# EAGLE design AST1025 (EAGLE 6.3)
DATABASE: ./../../../../../Components/TinyCircuits_Part_Database.txt
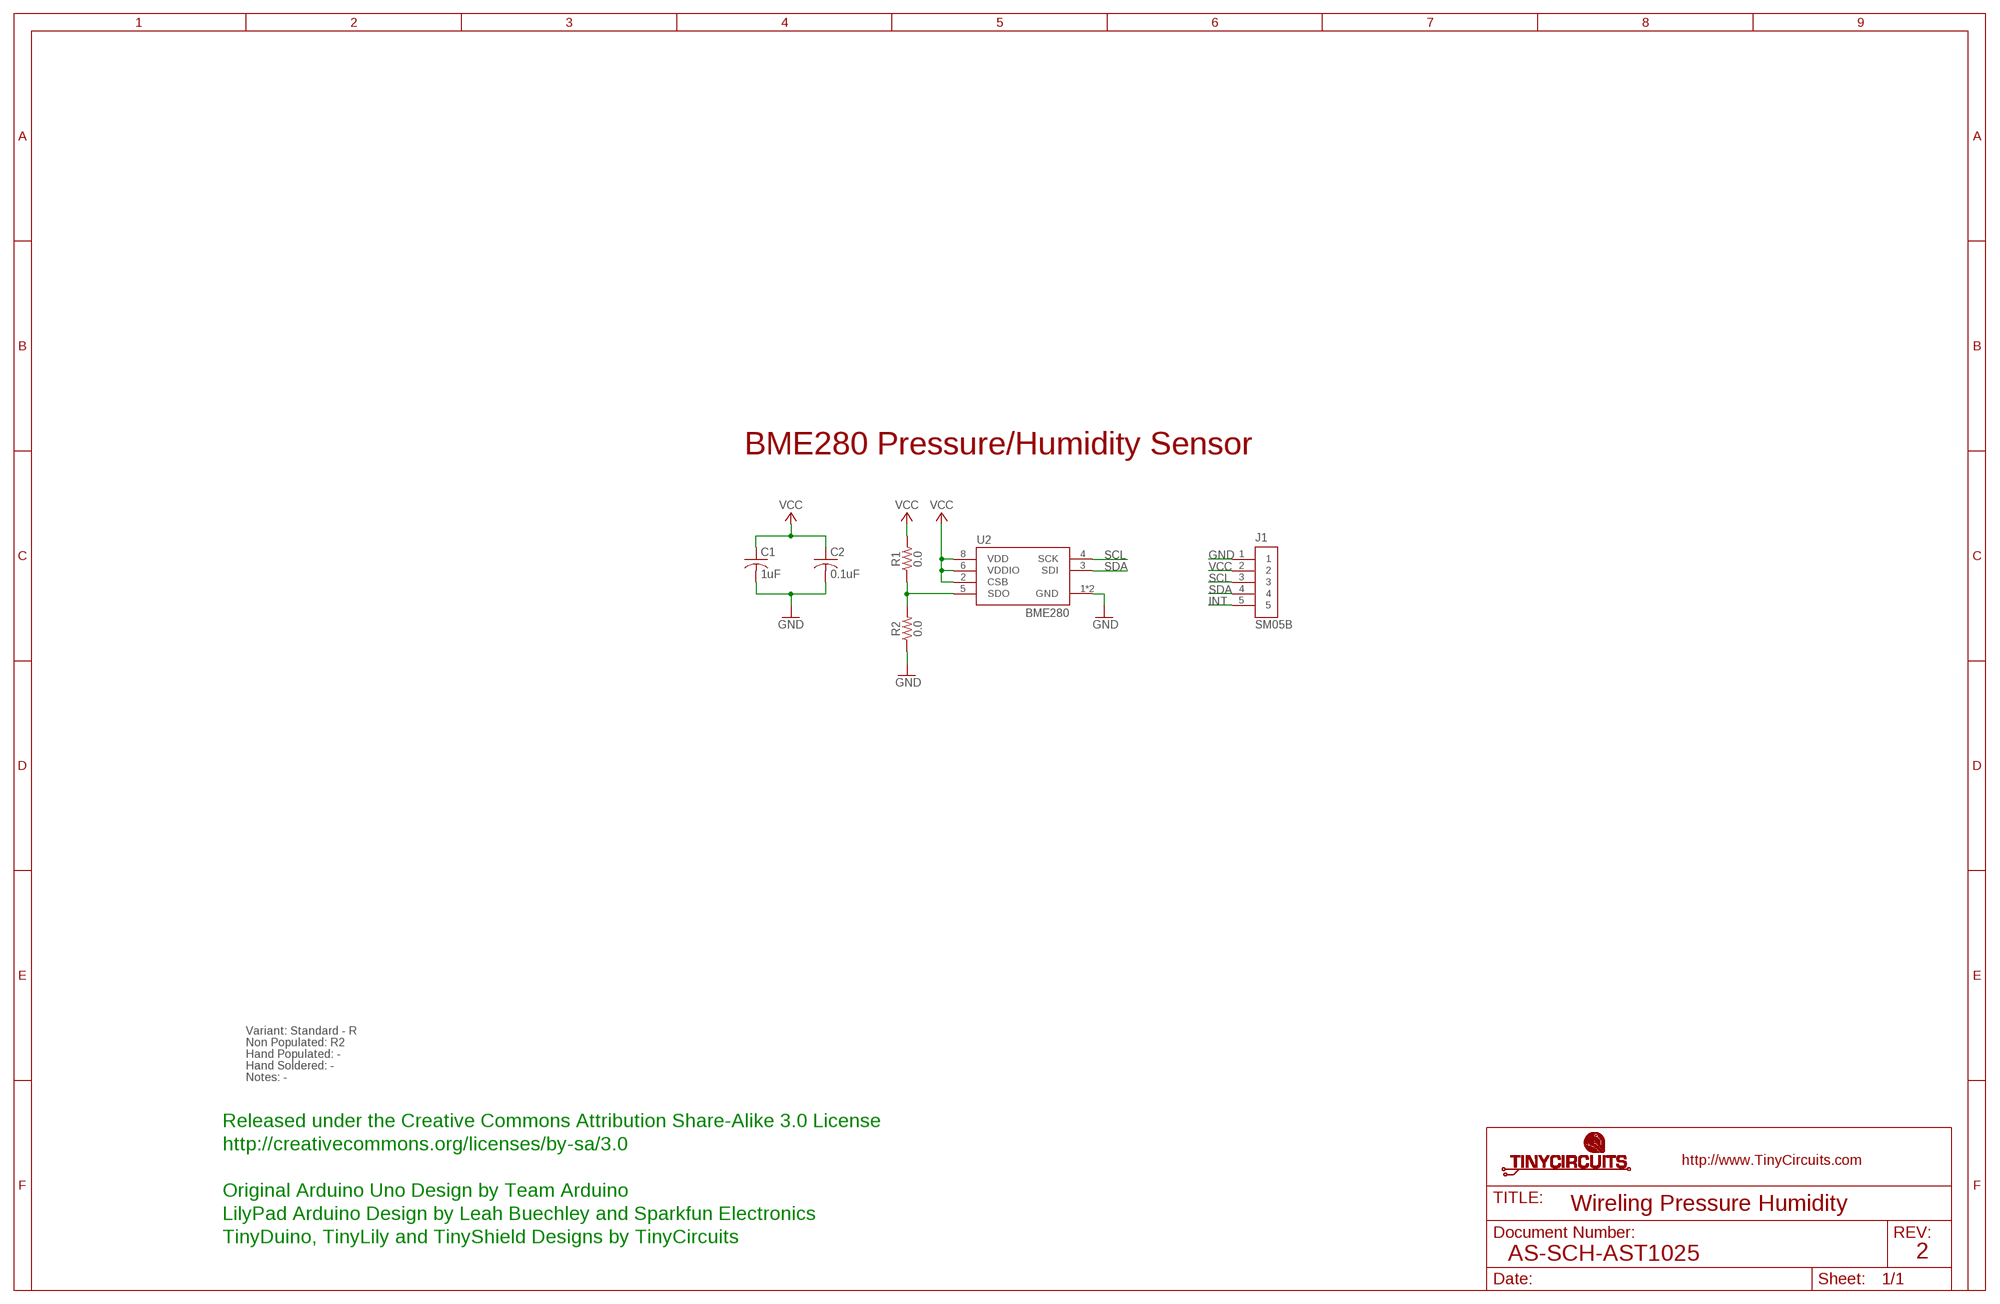
[diagram p0: schematic, sheet 1]

## Parts
C1  1uF  AS-ITM-00410  [C0603]
C2  0.1uF  AS-ITM-00008  [C0402]
J1  SM05B  AS-ITM-00340EDGE  [JST_SH_5X1_EDGE]
R1  0.0  AS-ITM-00076  [0402]
R2  0.0  AS-ITM-00076  [0402]
U2  BME280  AS-ITM-00365  [BME280]

## Nets
GND: C1.2 C2.2 J1.1 R2.1 U2.1(GND) U2.7(GND)
INT: J1.5
N$1: R1.1 R2.2 U2.5(SDO)
SCL: J1.3 U2.4(SCK)
SDA: J1.4 U2.3(SDI)
VCC: C1.1 C2.1 J1.2 R1.2 U2.2(CSB) U2.6(VDDIO) U2.8(VDD)

## Notes on the sheet
- BME280 Pressure/Humidity Sensor
- Variant: Standard - R
- Non Populated: R2
- Hand Populated: -
- Hand Soldered: -
- Notes: -
- Released under the Creative Commons Attribution Share-Alike 3.0 License
- http://creativecommons.org/licenses/by-sa/3.0
- Original Arduino Uno Design by Team Arduino
- Wireling Pressure Humidity
- LilyPad Arduino Design by Leah Buechley and Sparkfun Electronics
- TinyDuino, TinyLily and TinyShield Designs by TinyCircuits
- AS-SCH-AST1025 | 2

## Library data of the parts
C1 = tinycircuits:AS-ITM-00410: CAP CER 1UF 10V X5R 0603; PARTNO: AS-ITM-00410
C2 = tinycircuits:AS-ITM-00008: CAP CER 0.1UF 16V 10% X5R 0402; PARTNO: AS-ITM-00008
J1 = tinycircuits:AS-ITM-00340: CONN HEADER SH 5POS SIDE 1MM TIN; PARTNO: AS-ITM-00340; PNPROTATION: 180
R1 R2 = tinycircuits:AS-ITM-00076: RES 0.0 OHM 1/16W 1% 0402 SMD; PARTNO: AS-ITM-00076
U2 = tinycircuits:AS-ITM-00365: BME280 - SENSOR PRESSURE HUMIDITY TEMP; PARTNO: AS-ITM-00365

## Net classes
2 gnd: width 0.305 mm, drill 0.559 mm, clearance 0.254 mm

## Board
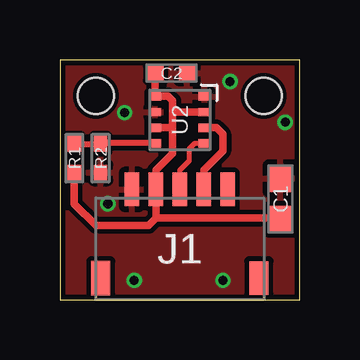
[diagram p1: board, top side]
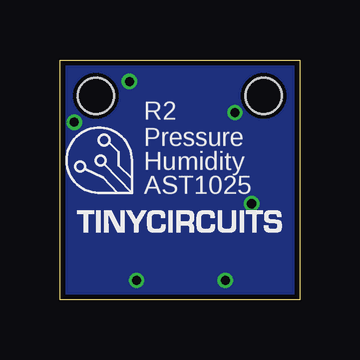
[diagram p2: board, bottom side, seen from below]

Size 10 x 10 mm. Coordinates in mm from the lower left corner, seen from the top.
Outline: 0,0 10,0 10,10 0,10 0,0
Copper layers (1*16): Top 0.035mm / dielectric 1.5mm / Bottom 0.035mm
Design rules "default *": minimum track width 8mil, minimum drill 15mil, track to track 8mil, track to pad 8mil, pad to pad 8mil, via to via 8mil, smd to smd 8mil, copper to edge 8mil, drill to drill 8mil, minimum pad ring 8mil, minimum via ring 5mil, stop-mask expansion 4mil, vias tented up to drill 25mil, thermal gap 10mil
Holes 1.5 mm at 1.5,8.5 8.5,8.5

### Footprints (pad centres in the part's own frame; a part is rotated, then mirrored left to right if it is on the bottom)
C0603 = smd 1.1 x 1: 1 -0.85,0; 2 0.85,0
C0402 = smd 0.65 x 0.6: 1 -0.65,0; 2 0.65,0
JST_SH_5X1_EDGE = smd 0.6 x 1.4: 1 -2,2.475; 2 -1,2.475; 3 0,2.475; 4 1,2.475; 5 2,2.475 | smd 0.8 x 1.4: PAD1 -3.3,-1.225; PAD2 3.3,-1.225
0402 = smd 0.65 x 0.55: 1 -0.6,0; 2 0.6,0
BME280 = smd 0.5 x 0.35: 1 1.025,0.975; 2 1.025,0.325; 3 1.025,-0.325; 4 1.025,-0.975; 5 -1.025,-0.975; 6 -1.025,-0.325; 7 -1.025,0.325; 8 -1.025,0.975

### Placement (x,y rotation side)
C1  9.2,4.2 90 top
C2  4.65,9.45 0 top
J1  5,2.12 0 top
R1  0.6,5.9 270 top
R2  1.7,5.9 90 top
U2  5,7.5 0 top
U$1  [DOCFIELD-TINYCIRCUITS-PCB]  19,-10 0 top  (outside the outline)

### Tracks (layer width: path | path; a pad name or v marks a point on that pad's centre or on a via)
GND  (via drill 0.38)
  other vias: 7.1,9.1 2,4 2.7,7.8 3.1,0.8 6.8,0.8 9.4,7.4
  pour Bottom: 0,10 10,10 10,0 0,0
  pour Top: 0,10 10,10 10,0 0,0
N$1
  Top 0.254: R1.1 R2.2 1.73,6.52 U2.5
SCL
  Top 0.203: J1.3 5,5.4 5.4,5.8 5.4,6.3 5.62,6.52 U2.4
SDA
  Top 0.305: U2.3 6.52,7.18 6.8,6.9 6.8,6.2 6,5.4 J1.4
VCC
  Top 0.305: C2.1 3.98,9.43 U2.8 4.1,8.5 4.5,8.5 4.7,8.3 4.7,7.8 | 4.7,7.2 4.7,6.1 4,5.4 J1.2 4,3.4 | 4.7,7.2 4.7,7.8 | U2.6 4.68,7.18 4.7,7.2 | U2.2 4.82,7.82 4.7,7.8 | 4,3.4 3.7,3.1 1.5,3.1 0.6,4 R1.2 | 4,3.4 9.15,3.4 C1.1

### Text on the board
bPlace: R2 | Pressure | Humidity | AST1025
Document: FABRICATION DRAWING | NOTES: | 1. PRINTED CIRCUIT BOARD MADE FROM NEMA GRADE FR-4 EPOXY LAMINATE | WITH 1 OUNCE COPPER PLATING AND .024 THICKNESS. | 2. ALL DIMENSIONS ARE GIVEN IN MILLIMETERS. | 3. CIRCUIT PATHS ARE FOR REFERENCE ONLY. | 4. HOLE SIZES SHOWN ARE FINISHED DIAMETERS AFTER PLATING. | 5. BOARD PLATED USING REFLOW OR SIMILAR METHOD. | 6. BOARD TO HAVE BLUE SOLDER MASK ON PLATED SURFACES USING WET FILM | 7. SILKSCREEN BOARD USING WHITE INK. | SR100 OR SR1010 EPOXY. EQUIVALENT WET OR DRY FILM MAY BE USED. | 8. THE FOLLOWING INFORMATION APPLIES TO THIS BOARD: | * 2 COPPER LAYERS | * .024 BOARD THICKNESS | * REQUIRES TOP SIDE SILKSCREEN | Released under the Creative Commons Attribution Share-Alike 3.0 License | http://creativecommons.org/licenses/by-sa/3.0 | Original Arduino Uno Design by Team Arduino | LilyPad Arduino Design by Leah Buechley and Sparkfun Electronics | TinyDuino, TinyLily and TinyShield Designs by TinyCircuits | Wireling Pressure Humidity | AS-PCB-AST1025 | 2